# EAGLE design 1bl (EAGLE 6.4)
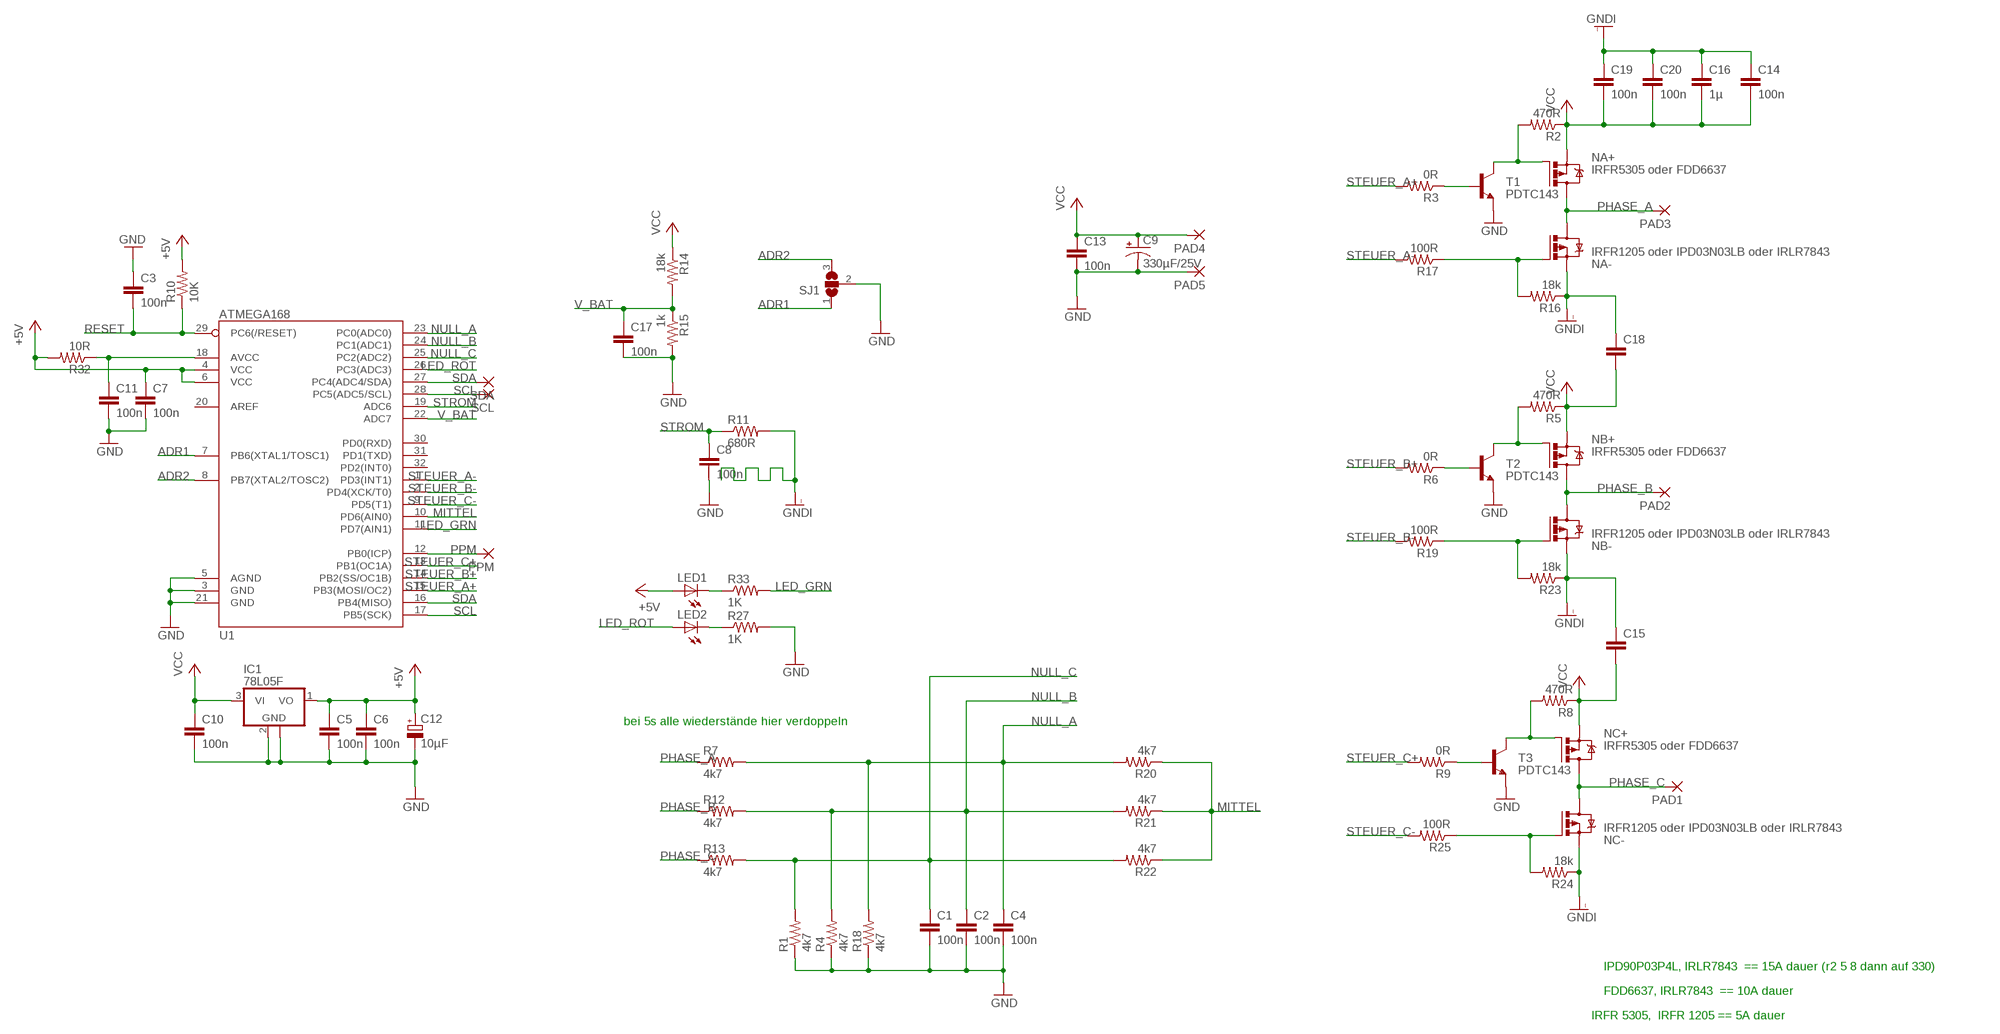
[diagram p0: schematic, sheet 1]

## Parts
C1  100n  CAP0805  [0805]
C2  100n  CAP0805  [0805]
C3  100n  CAP0805  [0805]
C4  100n  CAP0805  [0805]
C5  100n  CAP0805  [0805]
C6  100n  CAP0805  [0805]
C7  100n  CAP0805  [0805]
C8  100n  CAP0805  [0805]
C9  330µF/25V  CAP_POLPTH4  [CPOL-RADIAL-1000UF-25V]
C10  100n  CAP0805  [0805]
C11  100n  CAP0805  [0805]
C12  10µF  CPOL-EUB  [PANASONIC_B]
C13  100n  CAP0805  [0805]
C14  100n  CAP0805  [0805]
C15  CAP0805  [0805]
C16  1µ  CAP0805  [0805]
C17  100n  CAP0805  [0805]
C18  CAP0805  [0805]
C19  100n  CAP0805  [0805]
C20  100n  CAP0805  [0805]
IC1  78L05F  [SOT89]
LED1  LEDCHIP-LED0805  [CHIP-LED0805]
LED2  LEDCHIP-LED0805  [CHIP-LED0805]
NA+  IRFR5305 oder FDD6637  IRFR5305  [D-PAK_TO252AA]
NA-  IRFR1205 oder IPD03N03LB oder IRLR7843  IRFR5305  [D-PAK_TO252AA]
NB+  IRFR5305 oder FDD6637  IRFR5305  [D-PAK_TO252AA]
NB-  IRFR1205 oder IPD03N03LB oder IRLR7843  IRFR5305  [D-PAK_TO252AA]
NC+  IRFR5305 oder FDD6637  IRFR5305  [D-PAK_TO252AA]
NC-  IRFR1205 oder IPD03N03LB oder IRLR7843  IRFR5305  [D-PAK_TO252AA]
PAD1  SMD5  [SMD2,54-5,08]
PAD2  SMD5  [SMD2,54-5,08]
PAD3  SMD5  [SMD2,54-5,08]
PAD4  SMD5  [SMD2,54-5,08]
PAD5  SMD5  [SMD2,54-5,08]
PPM  SMD2  [SMD1,27-2,54]
R1  4k7  RESISTOR  [0805]
R2  470R  RESISTOR  [0805]
R3  0R  RESISTOR  [0805]
R4  4k7  RESISTOR  [0805]
R5  470R  RESISTOR  [0805]
R6  0R  RESISTOR  [0805]
R7  4k7  RESISTOR  [0805]
R8  470R  RESISTOR  [0805]
R9  0R  RESISTOR  [0805]
R10  10K  RESISTOR  [0805]
R11  680R  RESISTOR  [0805]
R12  4k7  RESISTOR  [0805]
R13  4k7  RESISTOR  [0805]
R14  18k  RESISTOR  [0805]
R15  1k  RESISTOR  [0805]
R16  18k  RESISTOR  [0805]
R17  100R  RESISTOR  [0805]
R18  4k7  RESISTOR  [0805]
R19  100R  RESISTOR  [0805]
R20  4k7  RESISTOR  [0805]
R21  4k7  RESISTOR  [0805]
R22  4k7  RESISTOR  [0805]
R23  18k  RESISTOR  [0805]
R24  18k  RESISTOR  [0805]
R25  100R  RESISTOR  [0805]
R27  1K  RESISTOR  [0805]
R32  10R  RESISTOR  [0805]
R33  1K  RESISTOR  [0805]
SCL  SMD2  [SMD1,27-2,54]
SDA  SMD2  [SMD1,27-2,54]
SJ1  SJ2W  [SJ_2]
T1  PDTC143  TRANSISTOR_NPNSOT23  [SOT23]
T2  PDTC143  TRANSISTOR_NPNSOT23  [SOT23]
T3  PDTC143  TRANSISTOR_NPNSOT23  [SOT23]
U1  ATMEGA168  [TQFP32-08]

## Nets
+5V: C5.1 C6.1 C7.1 C12.+ IC1.1(VO) LED1.A R10.2 R32.2 U1.4(VCC) U1.6(VCC)
ADR1: SJ1.1 U1.7(PB6(XTAL1/TOSC1))
ADR2: SJ1.3 U1.8(PB7(XTAL2/TOSC2))
GND: C1.2 C2.2 C3.1 C4.2 C5.2 C6.2 C7.2 C8.2 C9.2(-) C10.2 C11.2 C12.- C13.2 C17.2 IC1.2(GND) IC1.2@1(GND) PAD5.1(P) R1.1 R4.1 R15.2 R18.1 R27.2 SJ1.2 T1.2(E) T2.2(E) T3.2(E) U1.3(GND) U1.5(AGND) U1.21(GND)
GNDI: C14.1 C15.1 C16.1 C18.1 C19.1 C20.1 NA-.3(S) NB-.3(S) NC-.3(S) R11.2 R16.1 R23.1 R24.1
LED_GRN: R33.2 U1.11(PD7(AIN1))
LED_ROT: LED2.A U1.26(PC3(ADC3))
MITTEL: R20.1 R21.1 R22.1 U1.10(PD6(AIN0))
N$1: C11.1 R32.1 U1.18(AVCC)
N$3: NC+.1(G) R8.2 T3.3(C)
N$4: NB+.1(G) R5.2 T2.3(C)
N$5: NA+.1(G) R2.2 T1.3(C)
N$9: LED1.C R33.1
N$15: LED2.C R27.1
N$31: NA-.1(G) R16.2 R17.1
N$32: NB-.1(G) R19.1 R23.2
N$33: NC-.1(G) R24.2 R25.1
N$40: R3.1 T1.1(B)
N$41: R6.1 T2.1(B)
N$42: R9.1 T3.1(B)
NULL_A: C4.1 R7.2 R18.2 R20.2 U1.23(PC0(ADC0))
NULL_B: C2.1 R4.2 R12.2 R21.2 U1.24(PC1(ADC1))
NULL_C: C1.1 R1.2 R13.2 R22.2 U1.25(PC2(ADC2))
PHASE_A: NA+.4(D) NA-.4(D) PAD3.1(P) R7.1
PHASE_B: NB+.4(D) NB-.4(D) PAD2.1(P) R12.1
PHASE_C: NC+.4(D) NC-.4(D) PAD1.1(P) R13.1
PPM: PPM.1(P) U1.12(PB0(ICP))
RESET: C3.2 R10.1 U1.29(PC6(/RESET))
SCL: SCL.1(P) U1.17(PB5(SCK)) U1.28(PC5(ADC5/SCL))
SDA: SDA.1(P) U1.16(PB4(MISO)) U1.27(PC4(ADC4/SDA))
STEUER_A+: R3.2 U1.15(PB3(MOSI/OC2))
STEUER_A-: R17.2 U1.1(PD3(INT1))
STEUER_B+: R6.2 U1.14(PB2(SS/OC1B))
STEUER_B-: R19.2 U1.2(PD4(XCK/T0))
STEUER_C+: R9.2 U1.13(PB1(OC1A))
STEUER_C-: R25.2 U1.9(PD5(T1))
STROM: C8.1 R11.1 U1.19(ADC6)
V_BAT: C17.1 R14.2 R15.1 U1.22(ADC7)
VCC: C9.1(+) C10.1 C13.1 C14.2 C15.2 C16.2 C18.2 C19.2 C20.2 IC1.3(VI) NA+.3(S) NB+.3(S) NC+.3(S) PAD4.1(P) R2.1 R5.1 R8.1 R14.1
Unconnected: U1.20(AREF) U1.30(PD0(RXD)) U1.31(PD1(TXD)) U1.32(PD2(INT0))

## Notes on the sheet
- bei 5s alle wiederstände hier verdoppeln
- IPD90P03P4L, IRLR7843  == 15A dauer (r2 5 8 dann auf 330)
- FDD6637, IRLR7843  == 10A dauer
- IRFR 5305,  IRFR 1205 == 5A dauer

## Library data of the parts
C1-C8 C10 C11 C13-C20 = SparkFun:CAP: Capacitor Standard 0603 ceramic capacitor, and 0.1" leaded capacitor.
C9 = SparkFun:CAP_POL: Capacitor Polarized These are standard SMD and PTH capacitors. Normally 10uF, 47uF, and 100uF in electrolytic and tantalum varieties. Always verify the external diameter of the through hole cap, it varies with capacity, voltage, and manufacturer. The EIA devices should be standard.
C12 = resistor:CPOL-EU: POLARIZED CAPACITOR, European symbol
IC1 = linear:78L*: POSITOIV-VOLTAGE REGULATORS Output up to 100 mA Source: http://focus.ti.com/lit/ds/symlink/ua78l05.pdf
LED1 LED2 = led:LED: LED OSRAM: - CHIPLED LG R971, LG N971, LY N971, LG Q971, LY Q971, LO R971, LY R971 LH N974, LH R974 LS Q976, LO Q976, LY Q976 LO Q996 - Hyper CHIPLED LW Q18S LB Q993, LB Q99A, LB R99A - SideLED LS A670, LO A670, LY A670, LG A670, LP A670 LB A673, LV A673, LT A673, LW A673 LH A674 LY A675 LS A676, LA A676, LO A676, LY A676, LW A676 LS A679, LY A679, LG A679 - Hyper Micro SIDELED® LS Y876, LA Y876, LO Y876, LY Y876 LT Y87S - SmartLED LW L88C, LW L88S LB L89C, LB L89S, LG L890 LS L89K, LO L89K, LY L89K LS L896, LA L896, LO L896, LY L896 - TOPLED LS T670, LO T670, LY T670, LG T670, LP T670 LSG T670, LSP T670, LSY T670, LOP T670, LYG T670 LG T671, LOG T671, LSG T671 LB T673, LV T673, LT T673, LW T673 LH T674 LS T676, LA T676, LO T676, LY T676, LB T676, LH T676, LSB T676, LW T676 LB T67C, LV T67C, LT T67C, LS T67K, LO T67K, LY T67K, LW E67C LS E67B, LA E67B, LO E67B, LY E67B, LB E67C, LV E67C, LT E67C LW T67C LS T679, LY T679, LG T679 LS T770, LO T770, LY T770, LG T770, LP T770 LB T773, LV T773, LT T773, LW T773 LH T774 LS E675, LA E675, LY E675, LS T675 LS T776, LA T776, LO T776, LY T776, LB T776 LHGB T686 LT T68C, LB T68C - Hyper Mini TOPLED® LB M676 - Mini TOPLED Santana® LG M470 LS M47K, LO M47K, LY M47K Source: http://www.osram.convergy.de LUXEON: - LUMILED® LXK2-PW12-R00, LXK2-PW12-S00, LXK2-PW14-U00, LXK2-PW14-V00 LXK2-PM12-R00, LXK2-PM12-S00, LXK2-PM14-U00 LXK2-PE12-Q00, LXK2-PE12-R00, LXK2-PE12-S00, LXK2-PE14-T00, LXK2-PE14-U00 LXK2-PB12-K00, LXK2-PB12-L00, LXK2-PB12-M00, LXK2-PB14-N00, LXK2-PB14-P00, LXK2-PB14-Q00 LXK2-PR12-L00, LXK2-PR12-M00, LXK2-PR14-Q00, LXK2-PR14-R00 LXK2-PD12-Q00, LXK2-PD12-R00, LXK2-PD12-S00 LXK2-PH12-R00, LXK2-PH12-S00 LXK2-PL12-P00, LXK2-PL12-Q00, LXK2-PL12-R00 Source: www.luxeon.com KINGBRIGHT: KA-3528ASYC Source: www.kingbright.com
NA+ NA- NB+ NB- NC+ NC- = transistor-power:IRF?5305: HEXFET Power MOSFET Source: http://www.irf.com/product-info/datasheets/data/irfr5305pbf.pdf
PAD1-PAD5 = wirepad:SMD5: SMD PAD
PPM SCL SDA = wirepad:SMD2: SMD PAD
R1-R25 R27 R32 R33 = SparkFun:RESISTOR: Resistor Basic schematic elements and footprints for 0603, 1206, and PTH 1/10th watt (small) resistors.
SJ1 = jumper:SJ2W: SMD solder JUMPER
T1-T3 = SparkFun:TRANSISTOR_NPN: Transistor NPN BJT configuration in SOT23 package. MMBT2222 is the common NPN we use. Double check BCE configuration again layout.
U1 = SparkFun:ATMEGA168

## Board
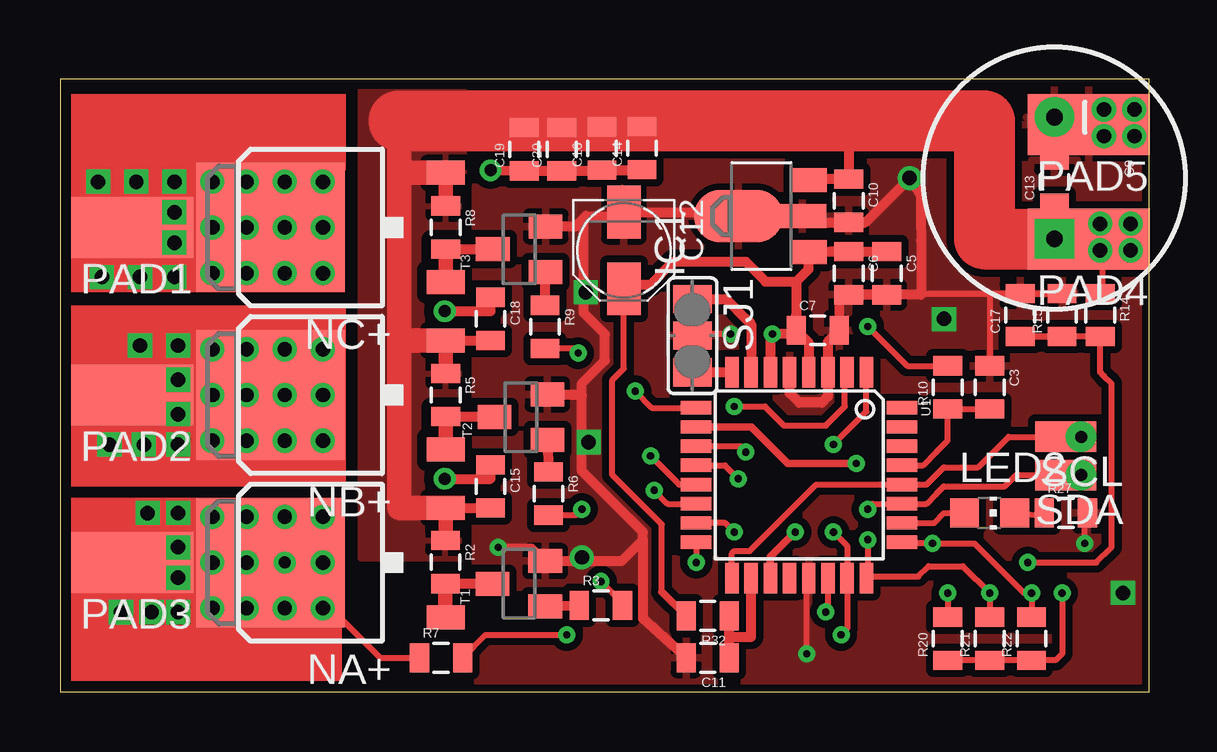
[diagram p1: board, top side]
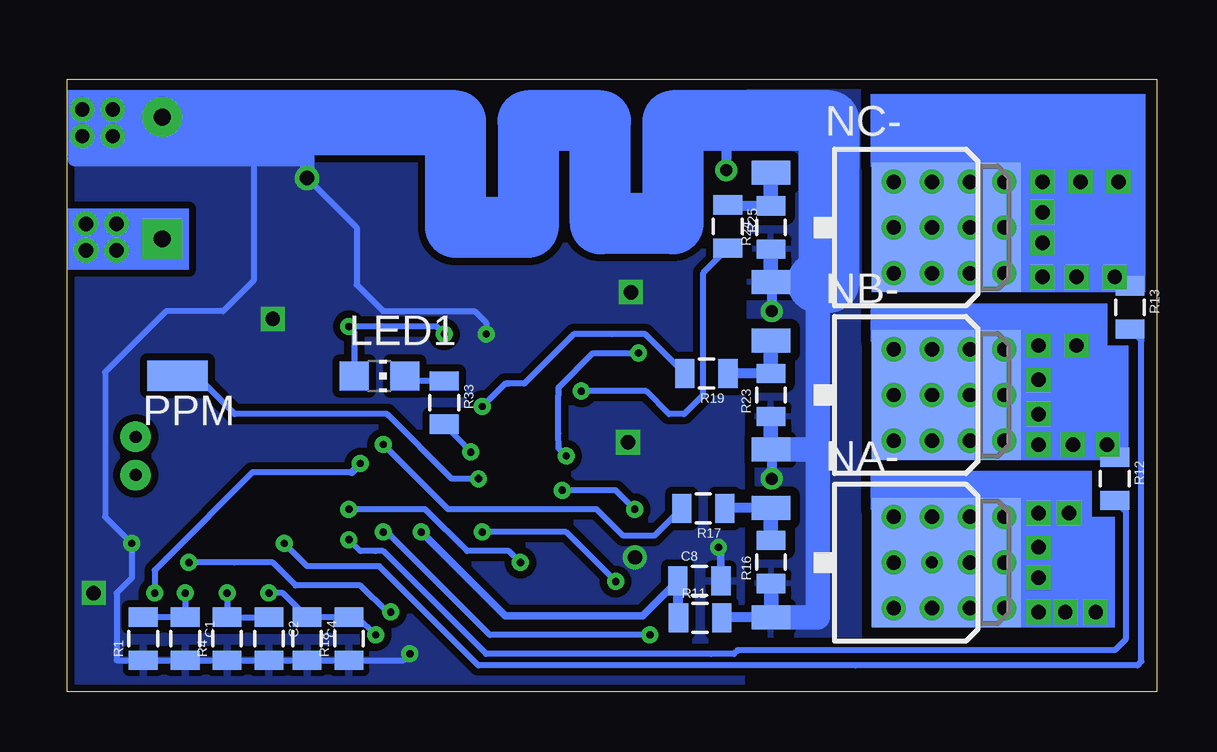
[diagram p2: board, bottom side, seen from below]

Size 45.39 x 25.55 mm. Coordinates in mm from the lower left corner, seen from the top.
Outline: 0,0 45.39,0 45.39,25.55 0,25.55 0,0
Copper layers (1*16): Top 0.035mm / dielectric 1.5mm / Bottom 0.035mm
Design rules "default *": minimum track width 10mil, minimum drill 0.3mm, track to track 8mil, track to pad 8mil, pad to pad 8mil, via to via 8mil, smd to smd 8mil, copper to edge 10mil, drill to drill 8mil, minimum pad ring 10mil, minimum via ring 8mil, stop-mask expansion 4mil, vias tented up to drill 0mil, thermal gap 10mil

### Footprints (pad centres in the part's own frame; a part is rotated, then mirrored left to right if it is on the bottom)
0805 = smd 0.8 x 1.2: 1 -0.9,0; 2 0.9,0
CPOL-RADIAL-1000UF-25V = drill 0.7 pad 1.651 square: 1 2.54,0 | drill 0.7 pad 1.651: 2 -2.54,0
PANASONIC_B = smd 2.2 x 1.4: + 1.6,0; - -1.6,0
SOT89 = smd 1 x 1.5: 1 -1.499,-1.981; 3 1.499,-1.981 | smd 1 x 2: 2 0,-1.727 | smd 2.2 x 3.7: 2@1 0,0.94
CHIP-LED0805 = smd 1.2 x 1.2: A 0,-1.05; C 0,1.05
D-PAK_TO252AA = smd 1 x 1.6: 1 -2.28,-4.8; 3 2.28,-4.8 | smd 5.4 x 6.2: 4 0,2.5
SMD2,54-5,08 = smd 2.54 x 5.08: 1 0,0
SMD1,27-2,54 = smd 1.27 x 2.54: 1 0,0
SJ_2 = smd 1.168 x 1.6: 1 -1.524,0; 2 0,0; 3 1.524,0
SOT23 = smd 1 x 1.4: 1 -0.95,-1.1; 2 0.95,-1.1; 3 0,1.1
TQFP32-08 = smd 1.27 x 0.559: 1 -4.293,2.8; 2 -4.293,2; 3 -4.293,1.2; 4 -4.293,0.4; 5 -4.293,-0.4; 6 -4.293,-1.2; 7 -4.293,-2; 8 -4.293,-2.8; 17 4.293,-2.8; 18 4.293,-2; 19 4.293,-1.2; 20 4.293,-0.4; 21 4.293,0.4; 22 4.293,1.2; 23 4.293,2; 24 4.293,2.8 | smd 0.559 x 1.27: 9 -2.8,-4.293; 10 -2,-4.293; 11 -1.2,-4.293; 12 -0.4,-4.293; 13 0.4,-4.293; 14 1.2,-4.293; 15 2,-4.293; 16 2.8,-4.293; 25 2.8,4.293; 26 2,4.293; 27 1.2,4.293; 28 0.4,4.293; 29 -0.4,4.293; 30 -1.2,4.293; 31 -2,4.293; 32 -2.8,4.293

### Placement (x,y rotation side)
C1  40.48,2.22 270 bottom
C2  36.99,2.22 270 bottom
C3  38.74,12.7 270 top
C4  35.4,2.22 270 bottom
C5  34.45,17.46 270 top
C6  32.86,17.46 270 top
C7  31.57,15.08 0 top
C8  19.06,4.64 0 bottom
C9  [CPOL-RADIAL-1000UF-25V]  41.43,21.43 270 top
C10  32.86,20.48 270 top
C11  26.99,1.43 180 top
C12  [PANASONIC_B]  23.49,18.41 270 top
C13  41.43,21.27 90 top
C14  24.25,22.68 90 top
C15  17.94,8.57 270 top
C16  22.58,22.66 90 top
C17  40,15.72 90 top
C18  17.94,15.56 270 top
C19  19.35,22.63 90 top
C20  20.9,22.63 90 top
IC1  29.21,19.84 90 top
LED1  32.39,13.18 270 bottom
LED2  38.74,7.46 270 top
NA+  IRFR5305  [D-PAK_TO252AA]  11.27,5.4 90 top
NA-  IRFR5305  [D-PAK_TO252AA]  11.27,5.4 270 bottom
NB+  IRFR5305  [D-PAK_TO252AA]  11.27,12.38 90 top
NB-  IRFR5305  [D-PAK_TO252AA]  11.27,12.38 270 bottom
NC+  IRFR5305  [D-PAK_TO252AA]  11.27,19.37 90 top
NC-  IRFR5305  [D-PAK_TO252AA]  11.27,19.37 270 bottom
PAD1  3.02,19.37 90 top
PAD2  3.02,12.38 90 top
PAD3  3.02,5.4 90 top
PAD4  42.86,18.89 90 top
PAD5  42.86,23.65 90 top
PPM  40.8,13.18 90 bottom
R1  [0805]  42.23,2.22 90 bottom
R2  [0805]  16.06,5.42 270 top
R3  [0805]  22.54,3.61 0 top
R4  [0805]  38.74,2.22 90 bottom
R5  [0805]  16.07,12.38 270 top
R6  [0805]  20.36,8.27 270 top
R7  [0805]  15.87,1.43 0 top
R8  [0805]  16.07,19.37 270 top
R9  [0805]  20.21,15.23 270 top
R10  [0805]  36.99,12.7 90 top
R11  [0805]  19.02,3.09 0 bottom
R12  [0805]  1.75,8.89 270 bottom
R13  [0805]  1.11,16.03 270 bottom
R14  [0805]  43.34,15.72 270 top
R15  [0805]  41.75,15.72 90 top
R16  [0805]  16.07,5.42 90 bottom
R17  [0805]  18.89,7.65 180 bottom
R18  [0805]  33.66,2.22 90 bottom
R19  [0805]  18.76,13.28 180 bottom
R20  [0805]  36.99,2.22 90 top
R21  [0805]  38.74,2.22 90 top
R22  [0805]  40.48,2.22 90 top
R23  [0805]  16.07,12.38 90 bottom
R24  [0805]  16.07,19.37 90 bottom
R25  [0805]  17.88,19.41 270 bottom
R27  [0805]  41.91,7.46 0 top
R32  [0805]  26.99,3.18 180 top
R33  [0805]  29.69,12.06 270 bottom
SCL  41.91,10.64 90 top
SDA  41.91,9.05 90 top
SJ1  26.35,14.86 270 top
T1  [SOT23]  19.12,4.51 90 top
T2  [SOT23]  19.21,11.46 90 top
T3  [SOT23]  19.13,18.46 90 top
U1  30.8,9.05 270 top

### Tracks (layer width: path | path; a pad name or v marks a point on that pad's centre or on a via)
+5V  (via drill 0.3)
  Top 0.254: R10.2 35.3,13.6 v33.66,15.24 | C5.1 34.77,18.36 | 25.08,4.18 25.08,6.98 23.02,9.05 23.02,13.02 23.5,13.49 C12.+ | C12.+
  Top 0.305: 25.08,4.18 R32.2
  Top 0.406: C5.1 32.07,18.36 C6.1 31.19,18.36 IC1.1 31.19,17.7 31.19,17.63 30.67,17.11 | 29.6,14.92 U1.6 | C7.1 30.37,14.92 v29.69,14.92 | v29.69,14.92 29.6,14.92 | U1.4 31.2,14.57 C7.1 | C12.+ 23.83,17.15 23.98,16.99 24.61,16.99 25.56,17.94 26.99,17.94 28.58,17.94 29.4,17.11 30.67,17.11 | 30.67,17.11 30.67,15.72 C7.1 | v29.69,14.92 29.6,14.92
  Bottom 0.254: LED1.A 33.44,15.02 v33.66,15.24 30,15.24 v29.69,14.92
ADR1
  Top 0.406: SJ1.1 27.75,16.38 28.58,15.56 28.8,15.34 U1.7
ADR2
  Top 0.406: SJ1.3 U1.8
GND  (via drill 0.3, 0.6)
  Top 0.254: v31.12,1.59 31.12,4.67 U1.21 | R15.2 C17.2 38.74,16.62 | R15.2 | v42.7,6.19 42.7,7.35 R27.2 | 35.88,16.56 34.82,16.62 38.74,16.62 | C3.1 | 38.74,16.62 C3.1 | v27.94,14.92 26.29,14.92 | v27.94,14.92
  Top 0.305: T1.2 19.65,6.03 v18.26,6.03
  Top 0.406: C13.2 C9.2 42.86,23.97 PAD5.1 | 33.02,16.56 C6.2 | 33.02,16.56 32.54,16.56 | 33.02,16.56 32.54,16.56 | 33.02,16.56 C5.2 | 33.02,16.56 35.88,16.56 35.88,18.83 35.87,19.7 35.87,20.71 v35.4,21.43 33.55,19.58 C10.2 29.83,19.58 IC1.2 IC1.2@1 28.1,20.01 C12.- 23.32,19.84 21.91,19.84 21.83,19.76 | 33.02,16.56 32.54,16.56 | 33.02,16.56 32.54,16.56 | 32.54,16.56 32.47,16.49 C7.2 32,14.61 U1.3 32,12.31 31.75,12.06 30.8,12.06 30.4,12.47 U1.5 | T1.2 23.4,5.46 24.29,6.35 | C11.2 24.29,3.07 24.29,6.35 | 24.29,6.35 24.29,6.67 | 24.29,6.35 24.29,6.67 | 24.29,6.67 21.75,9.21 21.75,12.38 | T2.2 20.31,12.38 21.75,12.38 | 21.75,12.38 21.75,12.86 22.7,13.81 22.7,14.92 21.83,15.8 21.83,19.76 | T3.2 21.47,19.41 21.83,19.76 | 26.29,14.92 SJ1.2
  Bottom 0.254: C4.2 R18.1 31.38,1.32 v31.12,1.59 | C4.2 | C2.2 C4.2 | C2.2 | R4.1 C2.2 | R4.1 | C1.2 R4.1 | C1.2 | R1.1 C1.2 | R1.1 | R1.1 43.34,1.32 43.34,4.13 42.7,4.76 42.7,6.03 v42.7,6.19 43.82,7.3 43.82,13.33 41.28,15.88 38.89,15.88 37.62,17.15 37.62,22.07 37.47,22.22 | 45.09,22.22 45.24,22.38 | v35.4,21.43 33.34,19.37 33.34,16.99 32.23,15.88 28.42,15.88 27.94,15.4 v27.94,14.92
  Bottom 0.305: v18.26,6.03 18.16,5.93 C8.2
  Bottom 0.61: v35.4,21.43 35.4,22.22 | 35.4,22.22 35.4,23.97 C9.2 | 35.4,22.22 37.47,22.22 45.09,22.22
  other vias: 44.29,4.13 22.03,10.41 36.83,15.56 21.91,16.67 21.74,5.61
  pour Top (isolate 0.305): 45.4,25.24 17.3,25.24 17.3,0.16 45.4,0.16
  pour Bottom (isolate 0.305): 45.4,25.24 17.3,25.24 17.3,0 45.4,0
GNDI  (via drill 0.5)
  Top 0.406: C15.1 17.94,8.89 v16.03,8.89 | C18.1 17.94,15.88 v16.03,15.88 | 19.53,21.73 C19.1 | v17.94,21.75 19.53,21.73 | 19.53,21.73 C20.1 22.58,21.73 C16.1 24.25,21.76 C14.1
  Bottom 0.406: R11.2 18.12,3.12 NA-.3 | v16.03,8.89 16.03,10.1 NB-.3 | v16.03,15.88 16.03,17.09 NC-.3 | v17.94,21.75 17.94,23.81 19.69,23.81
  Bottom 0.61: NC-.3 R24.1 | NB-.3 R23.1 | NA-.3 16.03,3.16 16.03,3.17 16.07,3.21 R16.1
  Bottom 1.016: NC-.3 14.13,17.09 14.13,13.65 14.13,10.1 NB-.3 | NB-.3 14.13,10.1 14.13,4.45 14.13,3.12 NA-.3
  Bottom 2.54: 14.13,17.09 13.65,17.09 13.65,21.43 13.65,23.81 17.94,23.81 19.69,23.81 20.16,23.81 20.16,19.53 23.18,19.53 23.18,23.81 26.19,23.81 26.19,19.37 29.21,19.37 29.21,23.81 32.39,23.81
  pour Bottom (isolate 0.406, rank 2): 12.38,25.24 16.99,25.24 16.99,0 12.38,0
LED_GRN  (via drill 0.3)
  Top 0.254: U1.11 28.35,10.25 28.4,10.17 v28.58,10
  Bottom 0.254: v28.58,10 R33.2
LED_ROT
  Top 0.254: U1.26 36.42,7.05 36.83,7.46 37.62,7.46 LED2.A
MITTEL  (via drill 0.3)
  Top 0.254: R21.1 R20.1 | R21.1 | R22.1 R21.1 | R22.1 | R22.1 41.49,1.32 41.75,1.59 v41.75,4.13 | v41.75,4.13
  Top 0.305: v33.18,9.53 30.32,9.53 29.05,10.79 28.8,11.05 U1.10
  Bottom 0.254: 33.55,9.16 37.68,9.16 41.28,5.56 41.75,5.08 v41.75,4.13
  Bottom 0.305: v33.18,9.53 33.55,9.16
N$1
  Top 0.406: C11.1 27.88,2.31 | 27.88,2.31 R32.1 | U1.18 28.8,2.29 27.88,2.31
N$2  (via drill 0.6)
  other vias: 10.95,7.3
N$3
  Top 0.406: T3.3 R8.2
  Top 0.61: NC+.1 R8.2
N$4
  Top 0.406: T2.3 18.11,11.48 R5.2
  Top 0.61: NB+.1 R5.2
N$5
  Top 0.406: T1.3 R2.2
  Top 0.61: NA+.1 16.06,3.13 R2.2
N$6  (via drill 0.6)
  other vias: 10.95,5.4
N$7  (via drill 0.6)
  other vias: 10.95,3.49
N$8  (via drill 0.6)
  other vias: 9.37,3.49
N$9
  Bottom 0.254: R33.1 31.12,12.96 LED1.C
N$10  (via drill 0.6)
  other vias: 9.37,7.3
N$11  (via drill 0.6)
  other vias: 7.78,7.3
N$12  (via drill 0.6)
  other vias: 4.76,21.27
N$13  (via drill 0.6)
  other vias: 3.18,21.27
N$14  (via drill 0.6)
  other vias: 1.59,21.27
N$15
  Top 0.254: LED2.C 40.84,7.36 R27.1
N$16  (via drill 0.6)
  other vias: 4.76,17.3
N$17  (via drill 0.6)
  other vias: 3.33,17.3
N$18  (via drill 0.6)
  other vias: 1.75,17.3
N$19  (via drill 0.6)
  other vias: 7.78,5.4
N$20  (via drill 0.6)
  other vias: 7.78,3.49
N$21  (via drill 0.6)
  other vias: 10.95,14.29
N$22  (via drill 0.6)
  other vias: 10.95,12.38
N$23  (via drill 0.6)
  other vias: 4.92,14.45
N$24  (via drill 0.6)
  other vias: 3.33,14.45
N$25  (via drill 0.6)
  other vias: 10.95,10.48
N$26  (via drill 0.6)
  other vias: 9.37,10.48
N$27  (via drill 0.6)
  other vias: 9.37,14.29
N$28  (via drill 0.6)
  other vias: 4.92,10.32
N$29  (via drill 0.6)
  other vias: 3.49,10.32
N$30  (via drill 0.6)
  other vias: 7.78,14.29
N$31
  Bottom 0.406: R17.1 17.99,7.68 NA-.1
  Bottom 0.61: R16.2 NA-.1
N$32
  Bottom 0.406: R19.1 R23.2
  Bottom 0.61: R23.2 NB-.1
N$33
  Bottom 0.406: R25.1 17.79,20.27 R24.2
  Bottom 0.61: NC-.1 R24.2
N$34  (via drill 0.6)
  other vias: 7.78,10.48
N$35  (via drill 0.6)
  other vias: 10.95,17.46
N$36  (via drill 0.6)
  other vias: 10.95,19.37
N$37  (via drill 0.6)
  other vias: 10.95,21.27
N$38  (via drill 0.6)
  other vias: 9.37,21.27
N$39  (via drill 0.6)
  other vias: 9.37,17.46
N$40
  Top 0.406: R3.1 20.21,3.57 T1.1
N$41
  Top 0.254: T2.1 20.36,10.69
  Top 0.406: R6.1 20.35,10.51 T2.1
N$42
  Top 0.406: R9.1 T3.1
N$43  (via drill 0.6)
  other vias: 7.78,17.46
N$44  (via drill 0.6)
  other vias: 7.78,21.27
N$45  (via drill 0.6)
  other vias: 2.06,10.32
N$46  (via drill 0.6)
  other vias: 4.92,3.33
N$47  (via drill 0.6)
  other vias: 3.81,3.33
N$48  (via drill 0.6)
  other vias: 2.54,3.33
N$49  (via drill 0.6)
  other vias: 4.92,7.46
N$50  (via drill 0.6)
  other vias: 3.65,7.46
N$51  (via drill 0.6)
  other vias: 4.92,6.03
N$52  (via drill 0.6)
  other vias: 4.92,4.76
N$53  (via drill 0.6)
  other vias: 4.92,11.59
N$54  (via drill 0.6)
  other vias: 4.92,13.02
N$55  (via drill 0.6)
  other vias: 4.76,18.73
N$56  (via drill 0.6)
  other vias: 4.76,20
N$57  (via drill 0.5 pad 1.27)
  other vias: 42.55,10.64
N$58  (via drill 0.5 pad 1.27)
  other vias: 42.55,9.05
N$59  (via drill 0.6)
  other vias: 44.77,24.29
N$60  (via drill 0.6)
  other vias: 44.77,23.18
N$61  (via drill 0.6)
  other vias: 43.5,23.18
N$62  (via drill 0.6)
  other vias: 43.5,24.29
N$63  (via drill 0.6)
  other vias: 44.61,18.41
N$64  (via drill 0.6)
  other vias: 44.61,19.53
N$65  (via drill 0.6)
  other vias: 43.34,19.53
N$66  (via drill 0.6)
  other vias: 43.34,18.41
N$67
  Bottom 2.54: 32.23,23.81 32.54,23.81
NULL_A  (via drill 0.3)
  Top 0.254: R7.2 17.73,2.38 v21.11,2.38 | v32.23,6.67 32.8,6.1 U1.23 32.8,2.63 v32.54,2.38 | v36.99,4.13 R20.2 | v36.99,4.13
  Bottom 0.254: v21.11,2.38 27.78,2.38 31.91,6.51 | 31.91,6.51 32.07,6.51 | 31.91,6.51 32.07,6.51 | 31.91,6.51 32.07,6.51 | 32.07,6.51 v32.23,6.67 | v32.54,2.38 33.29,3.12 R18.2 C4.1 | C4.1 | v36.99,4.13 36.41,4.13 C4.1
NULL_B  (via drill 0.3)
  Top 0.254: v33.66,6.35 33.66,4.81 | 33.66,4.81 U1.24 | R4.2 v38.74,4.13 37.62,5.24 36.2,5.24 35.77,4.81 33.66,4.81
  Bottom 0.254: R12.2 1.27,7.51 1.27,2.22 1.75,1.75 12.54,1.75 17.46,1.75 17.62,1.59 18.57,1.59 27.94,1.59 32.23,5.87 | 32.23,5.87 32.54,5.87 | 32.23,5.87 32.54,5.87 | 32.23,5.87 32.54,5.87 | 32.54,5.87 33.18,5.87 v33.66,6.35 | R4.2 C2.1 | R4.2 | v38.74,4.13 R4.2
NULL_C  (via drill 0.3)
  Top 0.254: U1.25 35.15,6.19 v36.35,6.19 38.1,6.19 39.21,5.08 | C1.1 v40.48,4.13 40.16,4.13 39.21,5.08 | 39.21,5.08
  Bottom 0.254: R13.2 0.64,14.66 0.64,1.27 0.79,1.11 12.54,1.11 28.26,1.11 32.39,5.24 35.4,5.24 v36.35,6.19 | R1.2 C1.1 v40.48,4.13 | R1.2 | v40.48,4.13
PHASE_A  (via drill 0.5, 0.6)
  Top 0.254: v9.37,5.4 13.34,1.43 14.61,1.43 R7.1 | PAD3.1 v6.35,5.4 | R7.1
  Top 0.406: NA+.4 | v9.37,5.4 NA+.4
  Bottom 0.254: 7.73,6.03 NA+.4 8.36,4.99
  Bottom 0.406: v9.37,5.4 | NA+.4 v9.37,5.4
  Bottom 0.61: v6.35,7.3 6.35,6.03 7.73,6.03 7.73,5.4 v6.35,5.4 v6.35,3.49
PHASE_B  (via drill 0.6)
  Top 0.254: NB+.4 v9.37,12.38 PAD2.1
  Bottom 0.254: v7.78,12.38 v9.37,12.38 | v9.37,12.38 NB+.4 v9.37,12.38 | 7.01,12.2 7.2,12.38 v7.78,12.38 | R12.1 1.75,12.38 v7.78,12.38
  Bottom 0.61: v6.35,12.38 v6.35,10.48 | v6.35,12.38 6.35,12.2 7.01,12.2 | v6.35,12.38 v6.35,14.29
PHASE_C  (via drill 0.6)
  Top 0.254: NC+.4 v9.37,19.37 PAD1.1
  Bottom 0.254: v9.37,19.37 v7.78,19.37 6.88,19.37 6.85,19.34 R13.1 | v9.37,19.37 NC+.4 v9.37,19.37
  Bottom 0.61: v6.35,19.37 v6.35,17.46 | v6.35,19.37 6.35,19.34 6.85,19.34 | v6.35,19.37 v6.35,21.27
PPM  (via drill 0.3)
  Top 0.254: U1.12 27.71,9.45 v28.26,8.89
  Bottom 0.254: v28.26,8.89 29.37,8.89 32.07,11.59 38.42,11.59 40.16,13.33 40.32,13.18 PPM.1
RESET
  Top 0.254: C3.2 R10.1 36.99,10.48 36.51,10 35.96,9.45 U1.29
SCL
  Top 0.254: U1.17 28,5.77 28.1,5.87 28.73,5.87 29.85,6.98 30.8,7.94 30.87,8.01 31.51,8.65 33.41,8.65 U1.28 36.11,8.65 36.83,9.37 38.26,9.37 39.53,10.64 SCL.1
SDA  (via drill 0.3)
  Top 0.254: U1.16 26.61,6.35 U1.16 v26.51,5.4 | v33.66,7.62 33.88,7.85 U1.27 36.11,7.85 36.51,8.26 | 36.51,8.26 | 36.51,8.26 36.83,8.57 39.37,8.57 39.85,9.05 SDA.1
  Bottom 0.254: v26.51,5.4 26.99,5.87 28.73,5.87 30.48,7.62 v33.66,7.62
STEUER_A+  (via drill 0.3)
  Top 0.254: v28.1,6.67 27.72,7.05 U1.15 | v22.54,4.6 23.44,3.71 R3.2
  Bottom 0.254: v22.54,4.6 24.61,6.67 v28.1,6.67
STEUER_A-  (via drill 0.3)
  Top 0.254: v32.23,10.32 33.6,11.69 U1.1
  Bottom 0.254: R17.2 20.93,6.51 22.23,6.51 23.34,7.62 29.53,7.62 v32.23,10.32
STEUER_B+  (via drill 0.3)
  Top 0.254: v24.77,8.41 25.31,7.85 U1.14 | v21.75,7.62 21.5,7.37 R6.2
  Bottom 0.254: v21.75,7.62 22.54,8.41 v24.77,8.41
STEUER_B-  (via drill 0.3)
  Top 0.254: U1.2 32.7,13.25 32.7,11.91 31.91,11.11 31.43,11.11 30.16,11.11 29.37,11.91 v28.1,11.91
  Bottom 0.254: R19.2 21.31,14.92 22.7,14.92 24.29,14.92 | 24.29,14.92 | 24.29,14.92 26.35,12.86 27.15,12.86 | 27.15,12.86 26.99,12.86 27.15,12.86 | 27.15,12.86 v28.1,11.91
STEUER_C+  (via drill 0.3)
  Top 0.254: R9.2 21.39,14.33 v21.59,14.13 | v24.61,9.84 25.79,8.65 U1.13
  Bottom 0.254: v21.59,14.13 23.5,14.13 24.92,12.7 24.92,12.38 24.92,10.8 24.92,10.16 v24.61,9.84
STEUER_C-  (via drill 0.3)
  Top 0.254: U1.9 24.66,11.85 v23.97,12.54
  Bottom 0.254: R25.2 18.82,17.55 18.89,17.48 18.89,12.38 19.69,11.59 20.32,11.59 21.27,12.54 v23.97,12.54
STROM  (via drill 0.3)
  Top 0.305: v30.64,6.67 29.6,5.63 U1.19
  Bottom 0.305: C8.1 21.42,3.17 22.07,3.17 27.15,3.17 v30.64,6.67
  Bottom 0.406: C8.1 19.93,4.51 R11.1
V_BAT  (via drill 0.3)
  Top 0.254: U1.22 32,3.42 v31.91,3.33 | R15.1 C17.1 | R15.1 | C17.1 R15.1 | C17.1 R14.2 43.34,13.34 43.5,13.18 43.82,12.86 43.82,6.03 43.18,5.4 v40.32,5.4
  Bottom 0.254: v40.32,5.4 38.42,5.4 36.83,5.4 36.67,5.24 | 36.67,5.24 | 36.67,5.24 35.88,4.45 33.18,4.45 32.07,3.33 v31.91,3.33
VCC
  Top 0.254: 39.05,18.89 43.43,18.3 | 43.43,18.3 43.66,18.26 | R14.1 43.43,16.71 43.43,18.3
  Top 0.305: C20.2 21.31,23.53 | C16.2 22.54,23.56 22.54,23.65
  Top 0.406: NC+.3 16.07,21.7 | C18.2 NB+.3 | C15.2 NA+.3 | C13.1 C9.1 PAD4.1 | C19.2 C20.2 | 21.31,23.53 21.31,23.56 C16.2 | IC1.3 31.19,21.38 C10.1 32.86,23.81 31.91,23.81
  Top 0.61: NC+.3 R8.1 | R5.1 NB+.3 | R2.1 16.03,6.35 16.07,6.39 NA+.3
  Top 1.016: NA+.3 14.13,7.68 14.13,12.7 14.13,14.66 | 14.13,14.66 NB+.3 14.13,14.66 | 14.13,14.66 14.13,19.05 14.13,21.27 | 14.13,21.27 14.13,21.65 NC+.3 | 14.13,21.27 14.13,23.81 | C19.2 18.08,23.81 18.1,23.81 | C14.2 24.25,23.56 C16.2
  Top 2.54: PAD4.1 39.05,18.89 38.51,18.89 38.51,23.81 32.86,23.81 31.91,23.81 18.1,23.81 14.13,23.81
  pour Top (isolate 0.406, rank 2): 12.54,25.24 16.83,25.24 16.83,5.56 12.54,5.56
(copper drawn outside any net)
  shapes: Bottom area x10, Top area x6